# Altium schematic sheet Tinyputer_IFC.SchDoc
size A4
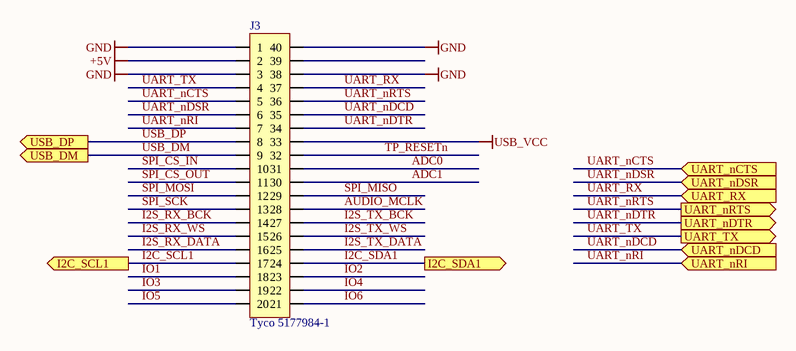
[diagram p0: Tinyputer_IFC.SchDoc]

## Parts
J3  Tyco 5177984-1  [TYCO_5177984-1]

## Ports
I2C_SCL1 (out), I2C_SDA1 (out), UART_nCTS (in), UART_nDCD (in), UART_nDSR (in), UART_nDTR (out), UART_nRI (in), UART_nRTS (out), UART_RX (in), UART_TX (out), USB_DM (out), USB_DP (out)

## Nets
+5V: J3.2
GND: J3.1 J3.3 J3.38 J3.40
USB_VCC: J3.33
ADC0: J3.31
ADC1: J3.30
AUDIO_MCLK: J3.28
I2C_SCL1: J3.17 ; port I2C_SCL1
I2C_SDA1: J3.24 ; port I2C_SDA1
I2S_RX_BCK: J3.14
I2S_RX_DATA: J3.16
I2S_RX_WS: J3.15
I2S_TX_BCK: J3.27
I2S_TX_DATA: J3.25
I2S_TX_WS: J3.26
IO1: J3.18
IO2: J3.23
IO3: J3.19
IO4: J3.22
IO5: J3.20
IO6: J3.21
SPI_CS_IN: J3.10
SPI_CS_OUT: J3.11
SPI_MISO: J3.29
SPI_MOSI: J3.12
SPI_SCK: J3.13
TP_RESETn: J3.32
UART_nCTS: J3.5 ; port UART_nCTS
UART_nDCD: J3.35 ; port UART_nDCD
UART_nDSR: J3.6 ; port UART_nDSR
UART_nDTR: J3.34 ; port UART_nDTR
UART_nRI: J3.7 ; port UART_nRI
UART_nRTS: J3.36 ; port UART_nRTS
UART_RX: J3.37 ; port UART_RX
UART_TX: J3.4 ; port UART_TX
USB_DM: J3.9 ; port USB_DM
USB_DP: J3.8 ; port USB_DP

Not connected (* = marked no-connect by the designer): J3 39

## Library data of the parts
J3 = CON_2x20_PLUG_0.8_Tyco: 0.8 mm dual row